# EAGLE design microbutton (EAGLE 7.5.0)
PRODUCT_COMPANY: skagmo.com, 2015; PRODUCT_TITLE: HAPCAN compatible DALI gateway, rev. A
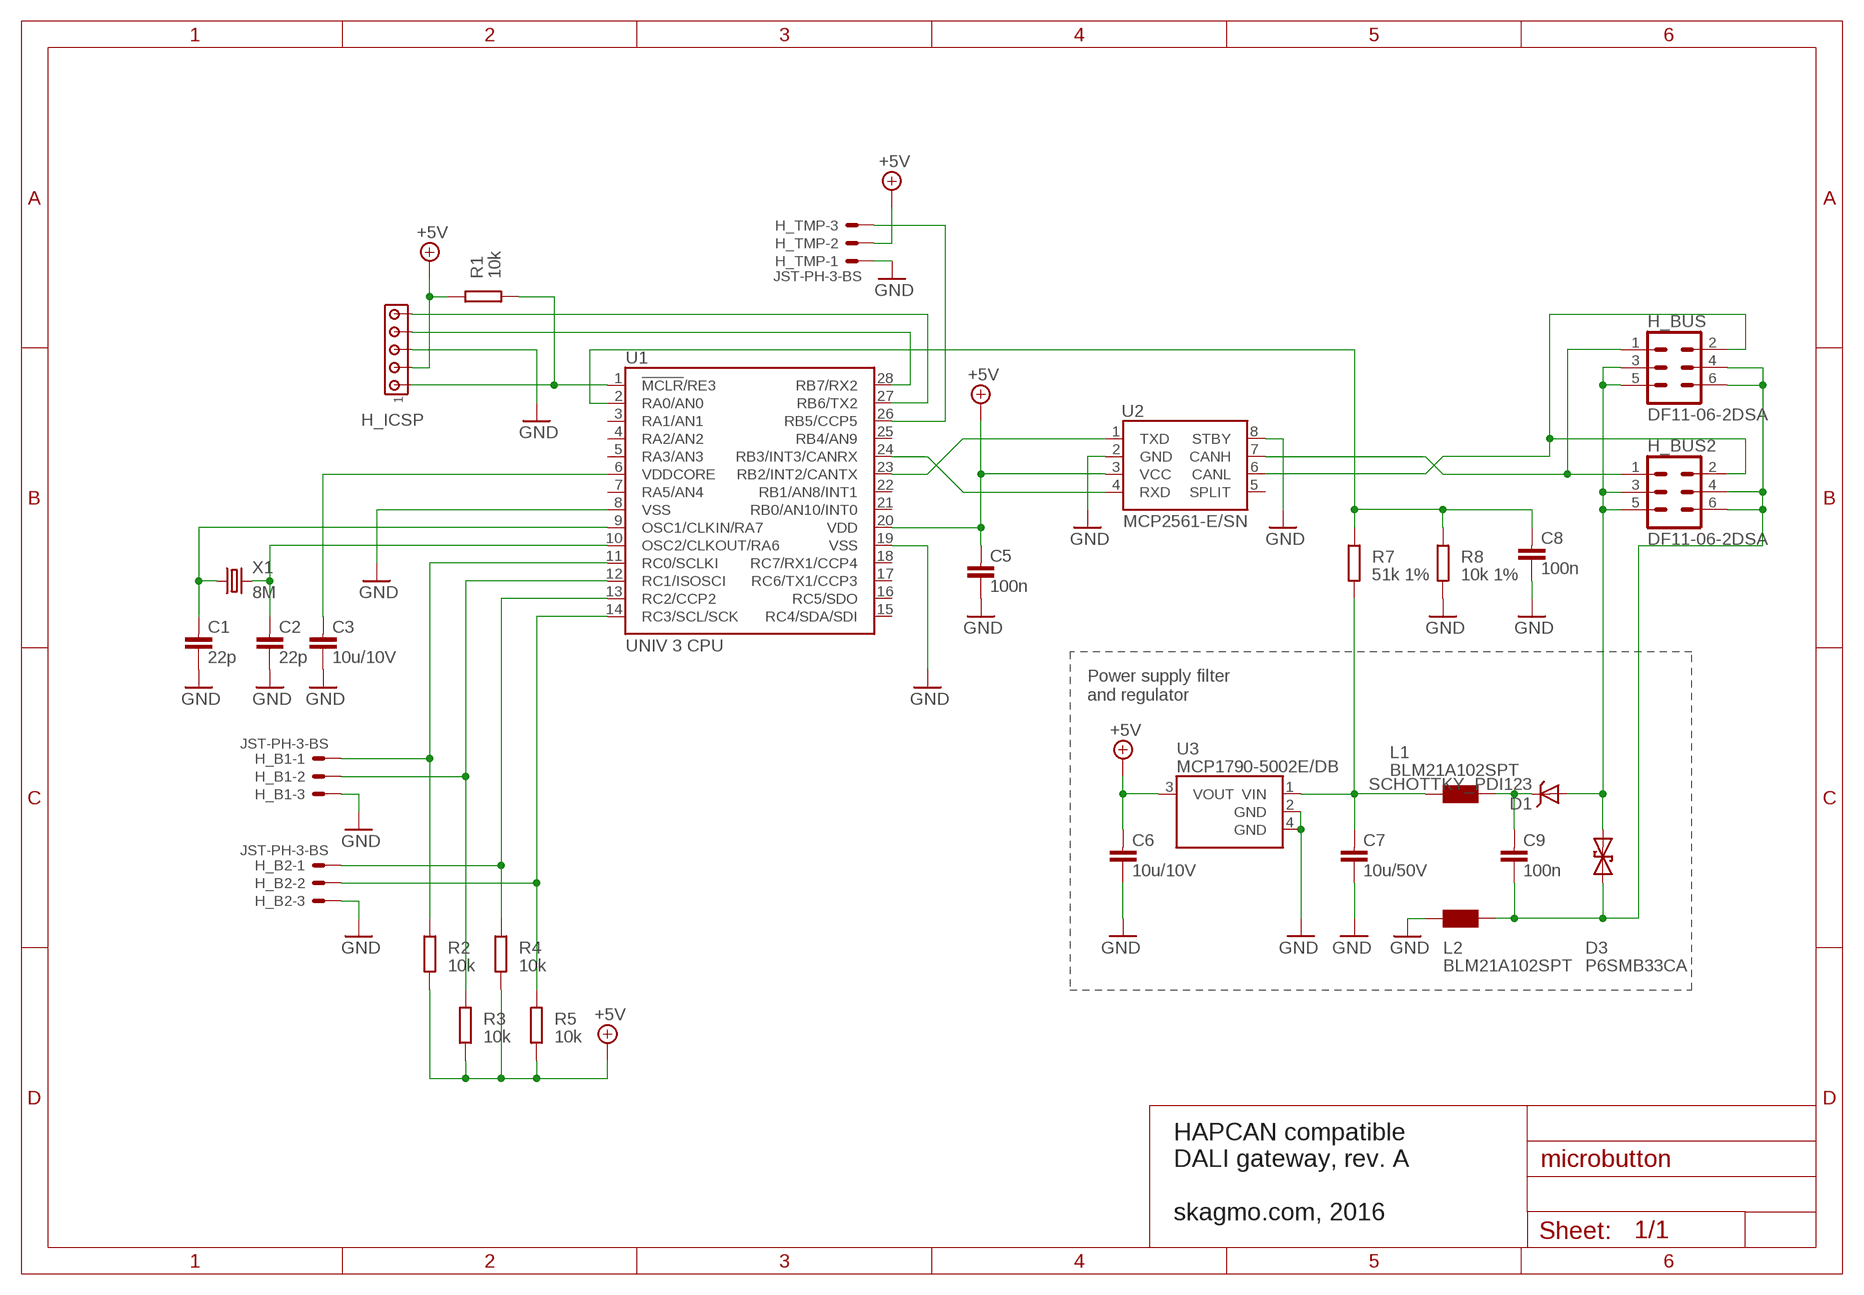
[diagram p0: schematic, sheet 1]

## Parts
C1  22p  CAPACITOR0805  [0805]
C2  22p  CAPACITOR0805  [0805]
C3  10u/10V  CAPACITOR0805  [0805]
C5  100n  CAPACITOR0805  [0805]
C6  10u/10V  CAPACITOR0805  [0805]
C7  10u/50V  CAPACITOR1210  [1210]
C8  100n  CAPACITOR0805  [0805]
C9  100n  CAPACITOR0805  [0805]
D1  SCHOTTKY_PDI123  [POWERDI123]
D3  P6SMB33CA  DIODE_TRANSIL2  [DO-214_TRANSIL2]
H_B1  JST-PH-3-BS  [B3B-PH-K-S]
H_B2  JST-PH-3-BS  [B3B-PH-K-S]
H_BUS  DF11-06-2DSA  [DF11-06DP-2DSA]
H_BUS2  DF11-06-2DSA  [DF11-06DP-2DSA]
H_ICSP  HEADER5  [SIP-5]
H_TMP  JST-PH-3-BS  [B3B-PH-K-S]
L1  BLM21A102SPT  CHOKE0805  [0805]
L2  BLM21A102SPT  CHOKE0805  [0805]
R1  10k  RESISTOR0805  [0805]
R2  10k  RESISTOR0805  [0805]
R3  10k  RESISTOR0805  [0805]
R4  10k  RESISTOR0805  [0805]
R5  10k  RESISTOR0805  [0805]
R7  51k 1%  RESISTOR0805  [0805]
R8  10k 1%  RESISTOR0805  [0805]
U1  UNIV 3 CPU  UNIV3CPU  [UNIV3CPU]
U2  MCP2561-E/SN  [SO-08]
U3  MCP1790-5002E/DB  MCP1790  [SOT-223]
X1  8M  CRYSTAL_TXC-7A  [TXC-7A]

## Nets
+5V: C5.1 C6.1 H_ICSP.2 H_TMP.2 R1.2 R2.1 R3.1 R4.1 R5.1 U1.20(VDD) U2.3(VCC) U3.3(VOUT)
CAN_N: H_BUS2.1 H_BUS.1 U2.7(CANH)
CAN_P: H_BUS2.2 H_BUS.2 U2.6(CANL)
GND: C1.2 C2.2 C3.2 C5.2 C6.2 C7.2 C8.2 H_B1.3 H_B2.3 H_ICSP.3 H_TMP.1 L2.1 R8.1 U1.8(VSS) U1.19(VSS) U2.2(GND) U2.8(STBY) U3.2(GND) U3.4(GND)
N$1: H_B1.1 R2.2 U1.11(RC0/SCLKI)
N$2: U1.24(RB3/INT3/CANRX) U2.4(RXD)
N$3: U1.23(RB2/INT2/CANTX) U2.1(TXD)
N$4: H_B1.2 R3.2 U1.12(RC1/ISOSCI)
N$5: C9.1 D1.C L1.2
N$6: H_B2.1 R4.2 U1.13(RC2/CCP2)
N$7: H_B2.2 R5.2 U1.14(RC3/SCL/SCK)
N$8: H_ICSP.1 R1.1 U1.1(!MCLR!/RE3)
N$9: D1.A D3.C H_BUS2.3 H_BUS2.5 H_BUS.3 H_BUS.5
N$10: H_ICSP.4 U1.28(RB7/RX2)
N$11: H_TMP.3 U1.26(RB5/CCP5)
N$14: H_ICSP.5 U1.27(RB6/TX2)
N$15: C2.1 U1.10(OSC2/CLKOUT/RA6) X1.2
N$16: C8.1 R7.2 R8.2 U1.2(RA0/AN0)
N$17: C7.1 L1.1 R7.1 U3.1(VIN)
N$22: C9.2 D3.A H_BUS2.4 H_BUS2.6 H_BUS.4 H_BUS.6 L2.2
N$40: C1.1 U1.9(OSC1/CLKIN/RA7) X1.1
N$56: C3.1 U1.6(VDDCORE)
Unconnected: U1.3(RA1/AN1) U1.4(RA2/AN2) U1.5(RA3/AN3) U1.7(RA5/AN4) U1.15(RC4/SDA/SDI) U1.16(RC5/SDO) U1.17(RC6/TX1/CCP3) U1.18(RC7/RX1/CCP4) U1.21(RB0/AN10/INT0) U1.22(RB1/AN8/INT1) U1.25(RB4/AN9) U2.5(SPLIT)

## Notes on the sheet
- Power supply filter
  and regulator
- HAPCAN compatible
  DALI gateway, rev. A
  
  skagmo.com, 2016

## Library data of the parts
C1-C3 C5-C9 = HAPCAN_devices - UNIV3:CAPACITOR: HAPCAN Capacitor
D1 = 00-mr-library:SCHOTTKY
D3 = HAPCAN_devices - UNIV3-eagle5:DIODE_TRANSIL2: HAPCAN Bidirectional transil diode
H_B1 H_B2 H_TMP = 10-pcb_libraries_con-jst-ph:JST-PH-3
H_BUS H_BUS2 = con-hirose-df11:DF11-06-2DSA: HEADER
H_ICSP = HAPCAN_devices - UNIV3:HEADER5: HAPCAN Header 5
L1 L2 = HAPCAN_devices - UNIV3:CHOKE: Choke
R1-R5 R7 R8 = HAPCAN_devices - UNIV3:RESISTOR: HAPCAN Resistor
U1 = HAPCAN_devices - UNIV3-eagle5:UNIV3CPU: HAPCAN Microcontroller UNIV 3 CPU
U2 = HAPCAN_devices - UNIV3:MCP2561: HAPCAN CAN Tranceiver
U3 = HAPCAN_devices - UNIV3:MCP1790: 70 mA, High Voltage Regulator
X1 = 00-mr-library:CRYSTAL

## Board
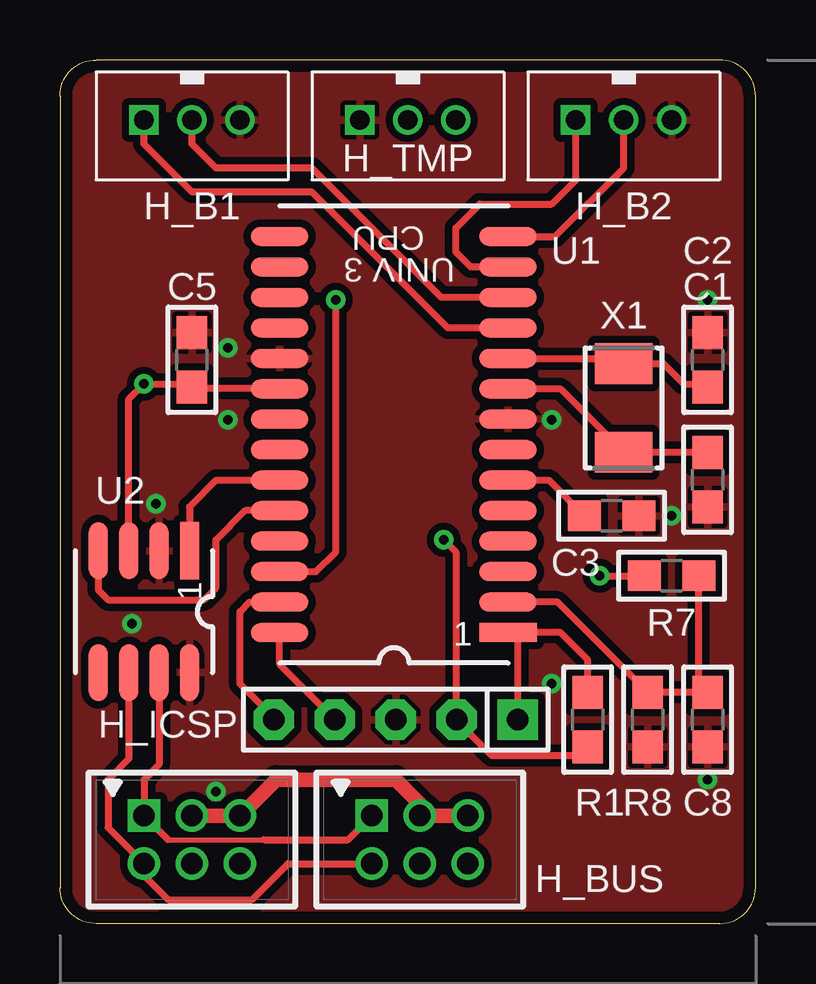
[diagram p1: board, top side]
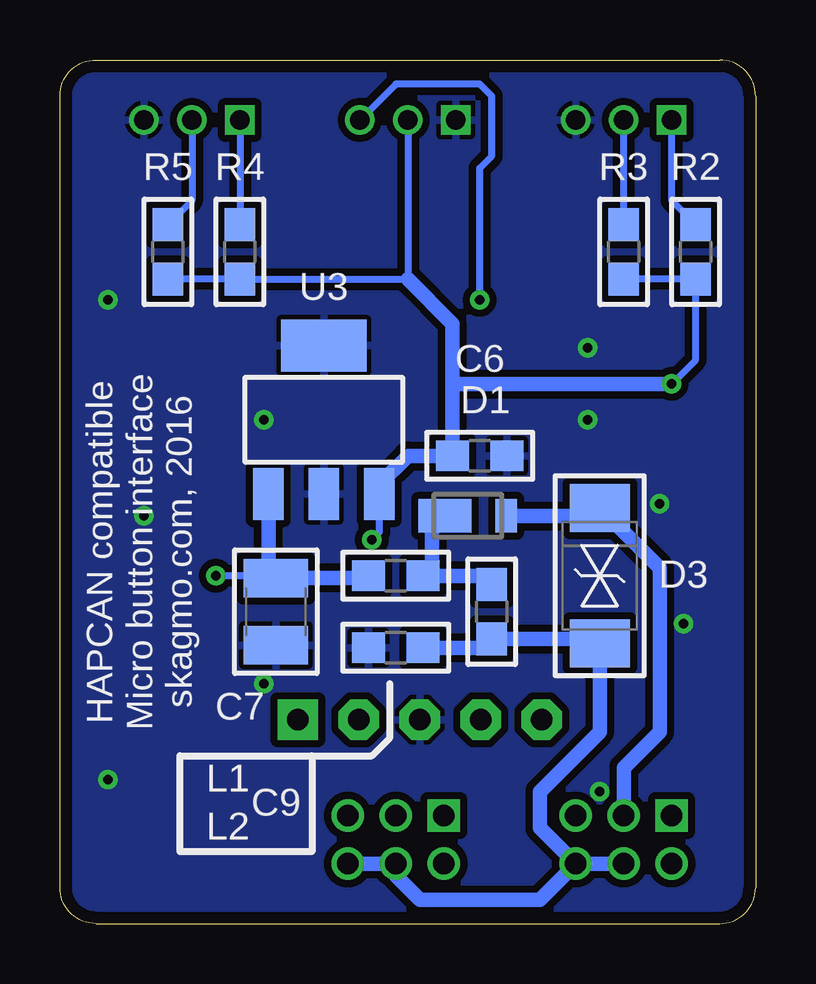
[diagram p2: board, bottom side, seen from below]

Size 29 x 36 mm. Coordinates in mm from the lower left corner, seen from the top.
Outline: 0,34.5 0,1.5 arc90 1.5,0 27.5,0 arc90 29,1.5 29,34.5 arc90 27.5,36 1.5,36 arc90 0,34.5
Copper layers (1+2*15+16): Top 0.035mm / dielectric 0.2mm / Route2 0.035mm / dielectric 1mm / Route15 0.035mm / dielectric 0.2mm / Bottom 0.035mm
Design rules "mr_drc *": minimum track width 0.15mm, minimum drill 0.3mm, track to track 0.15mm, track to pad 0.15mm, pad to pad 0.15mm, via to via 0.15mm, smd to smd 0.05mm, copper to edge 0.5mm, drill to drill 0.5mm, minimum pad ring 0.2mm, minimum via ring 0.2mm, stop-mask expansion 0.05mm, vias tented up to drill 0.8mm, thermal gap 0.2mm

### Footprints (pad centres in the part's own frame; a part is rotated, then mirrored left to right if it is on the bottom)
0805 = smd 1.372 x 1.27: 1 -1.143,0; 2 1.143,0
1210 = smd 1.6 x 2.7: 1 -1.4,0; 2 1.4,0
POWERDI123 = smd 0.9 x 1.4: A 1.6,0 | smd 2.2 x 1.4: C -0.95,0
DO-214_TRANSIL2 = smd 2 x 2.5: A 2.82,0; C -2.82,0
B3B-PH-K-S = drill 0.813 square: 1 2,0 | drill 0.813: 2 0,0; 3 -2,0
DF11-06DP-2DSA = drill 0.914 square: 1 2,-1 | drill 0.914: 2 2,1; 3 0,-1; 4 0,1; 5 -2,-1; 6 -2,1
SIP-5 = drill 0.9 pad 1.676 square: 1 -5.08,0 | drill 0.9 pad 1.676 octagon: 2 -2.54,0; 3 0,0; 4 2.54,0; 5 5.08,0
UNIV3CPU = smd 2.4 x 0.8: 1 -4.763,8.255; 2 -4.763,6.985; 3 -4.763,5.715; 4 -4.763,4.445; 5 -4.763,3.175; 6 -4.763,1.905; 7 -4.763,0.635; 8 -4.763,-0.635; 9 -4.763,-1.905; 10 -4.763,-3.175; 11 -4.763,-4.445; 12 -4.763,-5.715; 13 -4.763,-6.985; 14 -4.763,-8.255; 15 4.763,-8.255; 16 4.763,-6.985; 17 4.763,-5.715; 18 4.763,-4.445; 19 4.763,-3.175; 20 4.763,-1.905; 21 4.763,-0.635; 22 4.763,0.635; 23 4.763,1.905; 24 4.763,3.175; 25 4.763,4.445; 26 4.763,5.715; 27 4.763,6.985; 28 4.763,8.255
SO-08 = smd 2.4 x 0.8: 1 -2.54,1.905; 2 -2.54,0.635; 3 -2.54,-0.635; 4 -2.54,-1.905; 5 2.54,-1.905; 6 2.54,-0.635; 7 2.54,0.635; 8 2.54,1.905
SOT-223 = smd 1.27 x 2.159: 1 -2.311,-3.099; 2 0,-3.099; 3 2.311,-3.099 | smd 3.556 x 2.159: 4 0,3.099
TXC-7A = smd 1.7 x 2.4: 1 -1.85,0; 2 1.85,0

### Placement (x,y rotation side)
C1  27,18.5 270 top
C2  27,23.5 90 top
C3  23,17 0 top
C5  5.5,23.5 90 top
C6  11.5,19.5 0 bottom
C7  20,13 270 bottom
C8  27,8.5 270 top
C9  11,13 270 bottom
D1  12,17 0 bottom
D3  6.5,14.5 270 bottom
H_B1  5.5,33.5 180 top
H_B2  23.5,33.5 180 top
H_BUS  15,3.5 180 top
H_BUS2  5.5,3.5 180 top
H_ICSP  14,8.5 180 top
H_TMP  14.5,33.5 180 top
L1  15,14.5 0 bottom
L2  15,11.5 0 bottom
R1  22,8.5 270 top
R2  2.5,28 90 bottom
R3  5.5,28 90 bottom
R4  21.5,28 90 bottom
R5  24.5,28 90 bottom
R7  25.5,14.5 0 top
R8  24.5,8.5 90 top
U1  13.92,20.39 180 top
U2  3.5,13 270 top
U3  18,21 0 bottom
X1  23.5,21.5 90 top

### Tracks (layer width: path | path; a pad name or v marks a point on that pad's centre or on a via)
+5V  (via drill 0.4)
  Top 0.3: U1.20 6.07,22.29 C5.1 arc-90 5.64,22.5 v3.5,22.5 2.87,21.86 U2.3 | R1.2 21.64,7 18,7 16.54,8.46 H_ICSP.2 16.5,8.54 16.5,15.5 v16,16
  Bottom 0.3: R3.1 R2.1 2.5,23.5 v3.5,22.5 | R5.1 R4.1 14.5,26.86 H_TMP.2 | U3.3 15.69,16.31 v16,16
  Bottom 0.6: 12.64,22.5 v3.5,22.5 | U3.3 15.69,18.31 14.5,19.5 C6.1 12.64,22.5 | 12.64,22.5 12.64,25 14.5,26.86
CAN_N
  Top 0.2: 4.5,3.5 8.5,3.5
  Top 0.3: 4.5,3.5 H_BUS2.1 3.5,6 4.13,6.63 U2.7 | 8.5,3.5 12,3.5 H_BUS.1
CAN_P
  Top 0.3: H_BUS.2 9.5,2.5 8,1 4.5,1 3.5,2 H_BUS2.2 2,4 2,6 2.87,6.87 U2.6
GND  (via drill 0.4)
  Bottom 0.3: 13.86,8.64 H_ICSP.3
  other vias: 7,24 4,17.5 6.5,5.5 7,21 27,6 25.5,17 27,26 20.5,21 20.5,10 3,12.5
  pour Top (isolate 0.305): 29.5,-0.5 -0.5,-1.5 -1,37 29.5,36.5
  pour Bottom (isolate 0.305): 30,-1 -1,-2 -0.5,36.5 30,37
N$1
  Top 0.3: U1.11 16.17,24.83 10.5,30.5 5.5,30.5 3.5,32.5 H_B1.1
  Bottom 0.3: R2.2 3.5,30.14 H_B1.1
N$2
  Top 0.3: U2.4 1.59,13.9 2,13.5 6,13.5 6.5,14 6.5,16 7.71,17.21 U1.24
N$3
  Top 0.3: U1.23 6.52,18.48 5.41,17.37 U2.1
N$4
  Top 0.3: U1.12 15.9,26.1 10.5,31.5 6.5,31.5 5.5,32.5 H_B1.2
  Bottom 0.3: R3.2 H_B1.2
N$5
  Bottom 0.6: C9.1 11.36,14.5 L1.2 13.86,14.64 13.5,15 13.5,16.45 D1.C
N$6
  Top 0.3: U1.13 17.13,27.37 16.5,28 16.5,29 17.5,30 20.5,30 21.5,31 H_B2.1
  Bottom 0.3: H_B2.1 R4.2
N$7
  Top 0.3: U1.14 20.64,28.64 23.5,31.5 H_B2.2
  Bottom 0.3: H_B2.2 23.5,30.14 R5.2
N$8
  Top 0.3: H_ICSP.1 19.08,11.92 19,12 18.82,12 U1.1 20.87,12.13 22,11 R1.1
N$9
  Top 0.6: H_BUS2.3 H_BUS2.5 9,6 14,6 15,5 H_BUS.3 H_BUS.5
  Bottom 0.6: D1.A 7,17 D3.C 4,14.82 4,8 5.5,6.5 H_BUS2.3
N$10
  Top 0.3: H_ICSP.4 9.16,10.8 U1.28
N$11  (via drill 0.4)
  Top 0.3: U1.26 10.67,14.67 11.5,15.5 v11.5,26
  Bottom 0.3: v11.5,26 11.5,31.5 11,32 11,34.5 11.5,35 15,35 H_TMP.3
N$14
  Top 0.3: U1.27 7.9,13.4 7.5,13 7.5,10 8.92,8.58 H_ICSP.5
N$15
  Top 0.3: U1.10 23.29,23.56 X1.2 25.15,23.35 26,22.5 26.86,22.5 C2.1
N$16
  Top 0.3: C8.1 R8.2 20.74,13.4 U1.2 | 26.64,10 R7.2
  Top 0.4: C8.1 26.64,10
N$17  (via drill 0.4)
  Top 0.3: v22.5,14.5 R7.1
  Bottom 0.3: 19.9,14.5 C7.1 | 20.31,14.71 20.52,14.5 v22.5,14.5
  Bottom 0.6: U3.1 20.31,14.71 C7.1 16.24,14.4 L1.1
N$22
  Bottom 0.6: H_BUS.6 H_BUS.4 15,2 14,1 9,1 H_BUS2.6 | H_BUS2.4 H_BUS2.6 | H_BUS2.6 9,4 9,5.5 6.5,8 D3.A 7,11.86 C9.2 11.36,11.5 L2.2
N$40
  Top 0.3: U1.9 20.86,22.29 X1.1 C1.1
N$56
  Top 0.3: U1.6 20.38,18.48 C3.1

### Text on the board
bPlace: HAPCAN compatible / Micro button interface / skagmo.com, 2016